# Altium schematic sheet Power_Circuit.SchDoc (part 1 of 3)
size A2; SheetNumber: 15; SheetTotal: 16
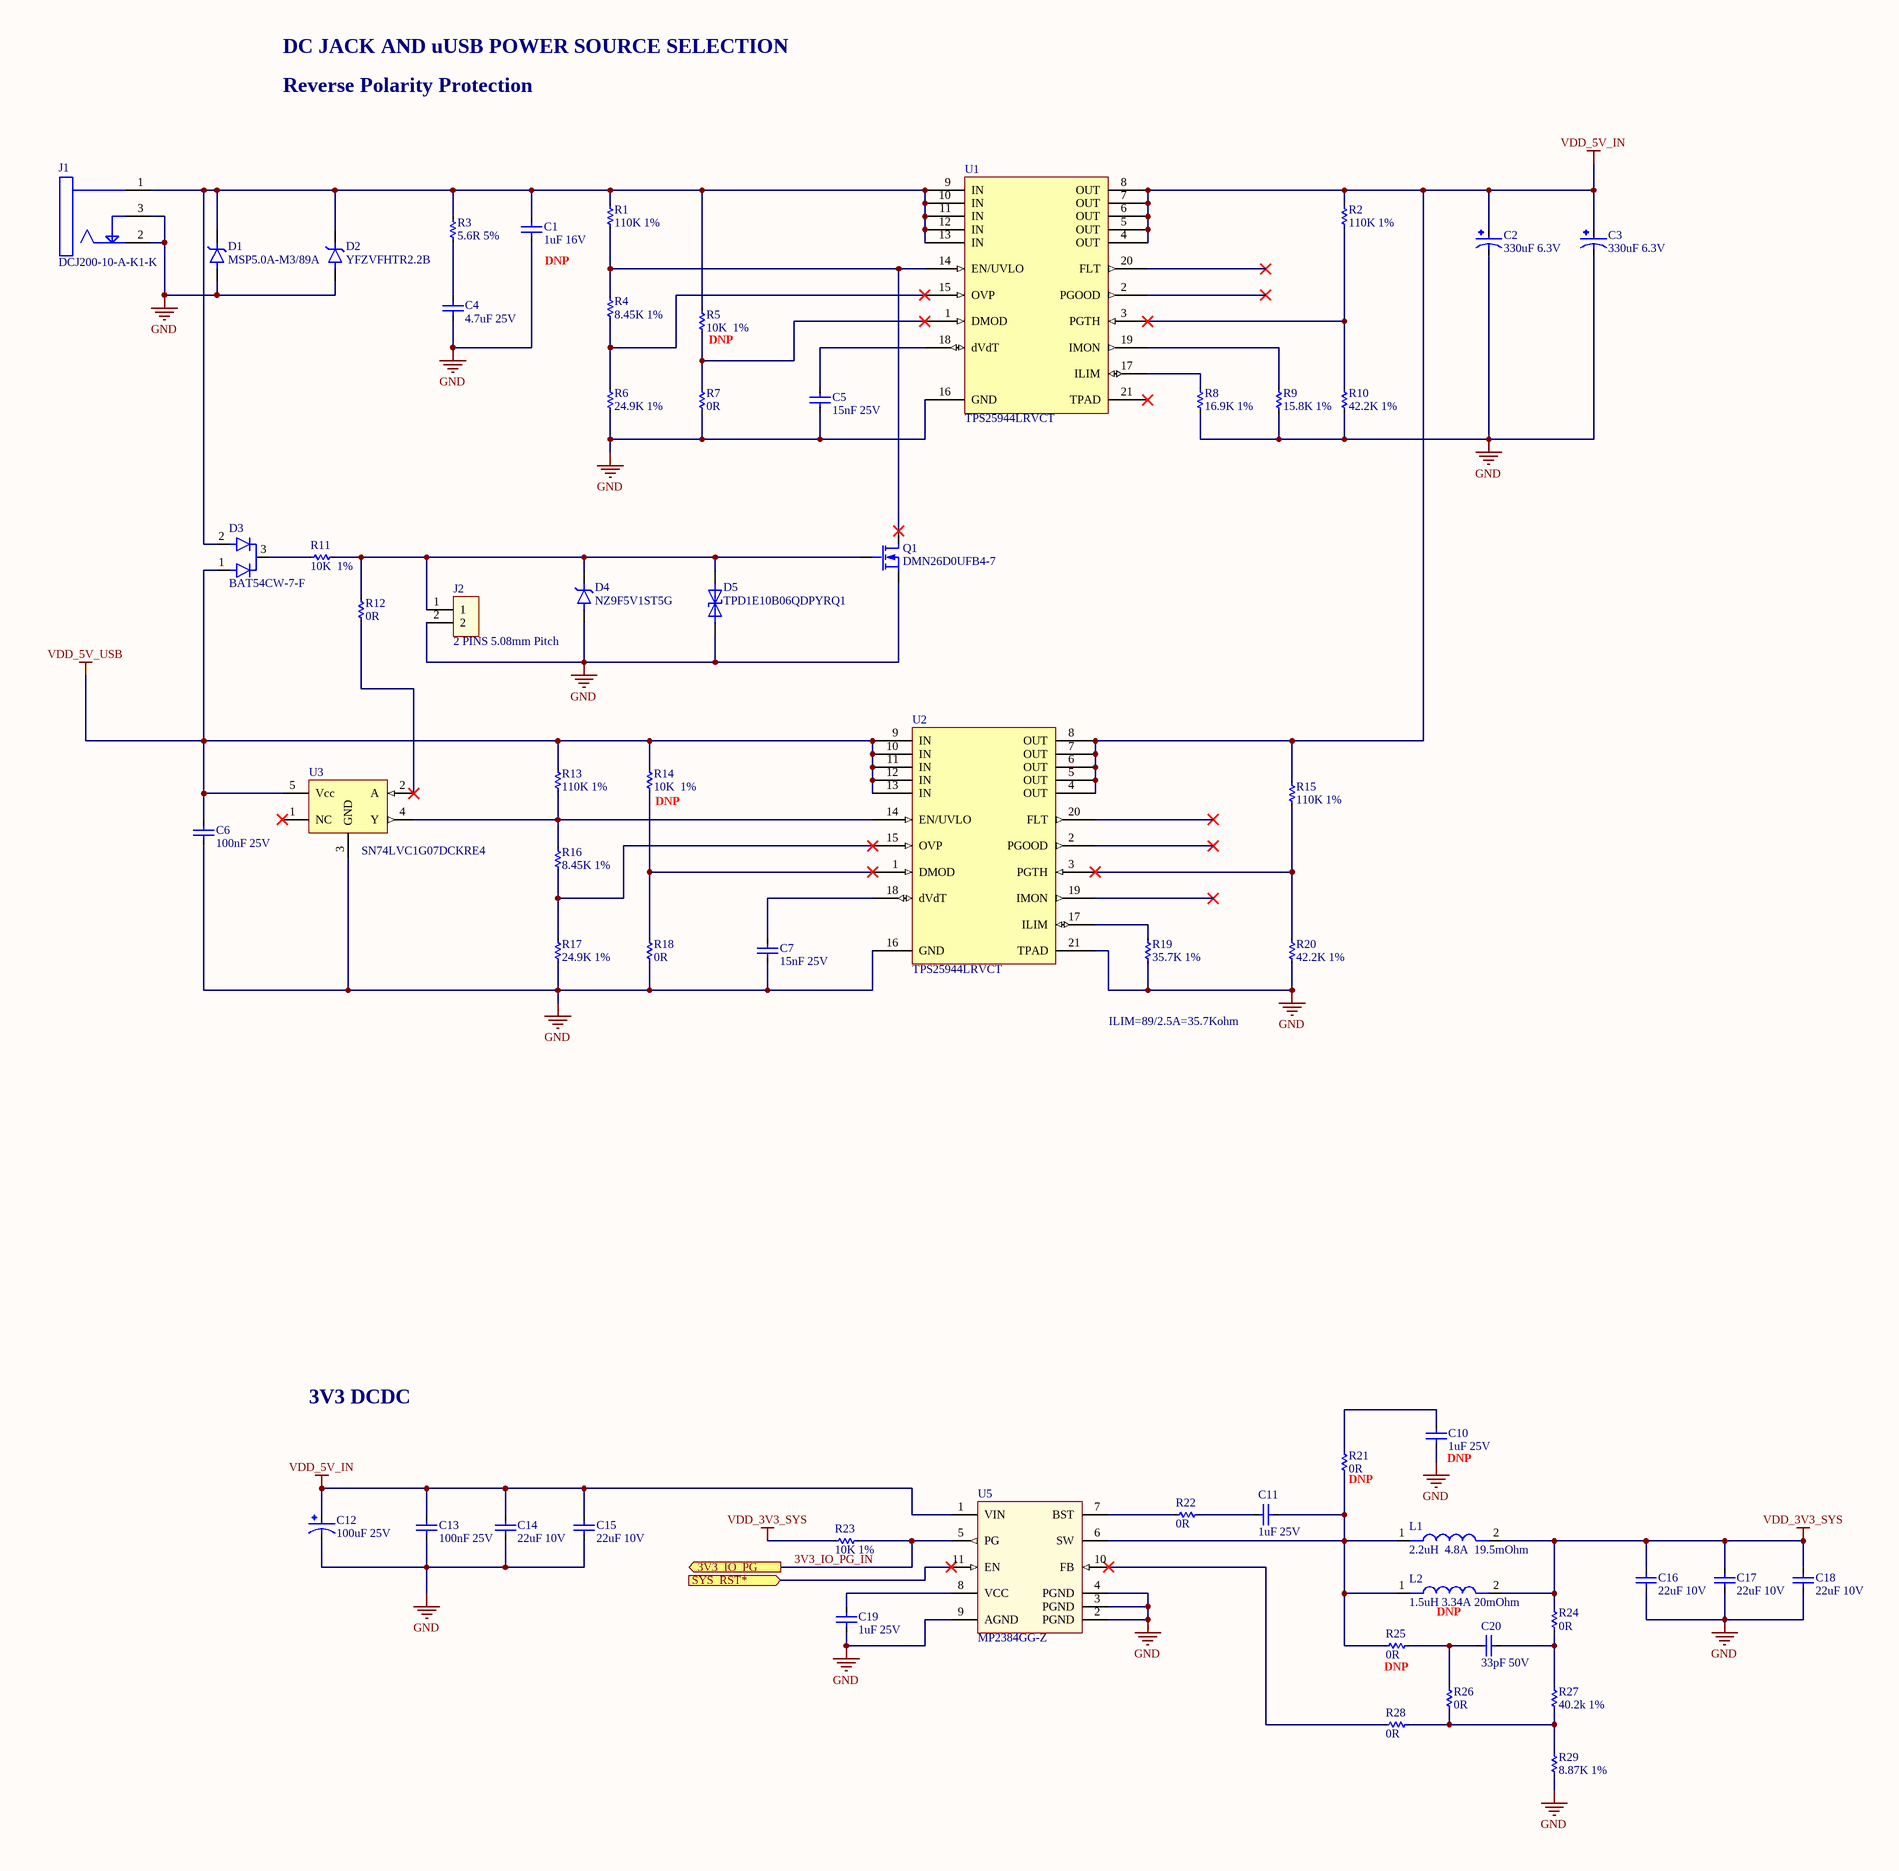
[diagram p0: Power_Circuit.SchDoc, left]
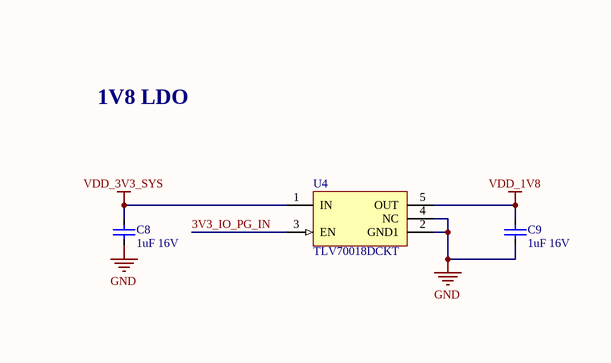
[diagram p1: Power_Circuit.SchDoc, right]

## Parts
C1  1uF 16V  [C0603]
C2  330uF 6.3V  [CP_ELEC_6.3x7.7]
C3  330uF 6.3V  [CP_ELEC_6.3x7.7]
C4  4.7uF 25V  [C0603]
C5  15nF 25V  [C0805]
C6  100nF 25V  [C0402]
C7  15nF 25V  [C0805]
C8  1uF 16V  [C0603]
C9  1uF 16V  [C0603]
C10  1uF 25V  [C0603]
C11  1uF 25V  [C0603]
C12  100uF 25V  [C2917_Tantalum]
C13  100nF 25V  [C0402]
C14  22uF 10V  [C0805]
C15  22uF 10V  [C0805]
C16  22uF 10V  [C0805]
C17  22uF 10V  [C0805]
C18  22uF 10V  [C0805]
C19  1uF 25V  [C0603]
C20  33pF 50V  [C0402]
D1  MSP5.0A-M3/89A  [DO-219AD]
D2  YFZVFHTR2.2B  [YFZVFHTR22B]
D3  BAT54CW-7-F  [SOT-323]
D4  NZ9F5V1ST5G  [SOD-923]
D5  TPD1E10B06QDPYRQ1  [2-X1SON (1x.60)]
J1  DCJ200-10-A-K1-K  [DCJ200-10-A-K1-K]
J2  2 PINS 5.08mm Pitch  [0395443002]
L1  2.2uH  4.8A  19.5mOhm  [NRS8030T2R2NJGJ]
L2  1.5uH 3.34A 20mOhm  [ASPI-4030S-1R5N-T]
Q1  DMN26D0UFB4-7  [DFN1006-3]
R1  110K 1%  [R0402]
R2  110K 1%  [R0402]
R3  5.6R 5%  [R0402]
R4  8.45K 1%  [R0402]
R5  10K  1%  [R0402]
R6  24.9K 1%  [R0402]
R7  0R  [R0603]
R8  16.9K 1%  [R0402]
R9  15.8K 1%  [R0603]
R10  42.2K 1%  [R0402]
R11  10K  1%  [R0402]
R12  0R  [R0603]
R13  110K 1%  [R0402]
R14  10K  1%  [R0402]
R15  110K 1%  [R0402]
R16  8.45K 1%  [R0402]
R17  24.9K 1%  [R0402]
R18  0R  [R0603]
R19  35.7K 1%  [R0402]
R20  42.2K 1%  [R0402]
R21  0R  [R0603]
R22  0R  [R0603]
R23  10K 1%  [R0603]
R24  0R  [R0603]
R25  0R  [R0603]
R26  0R  [R0603]
R27  40.2k 1%  [R0402]
R28  0R  [R0603]
R29  8.87K 1%  [R0402]
U1  TPS25944LRVCT  [WQFN (3x4)-20]
U2  TPS25944LRVCT  [WQFN (3x4)-20]
U3  SN74LVC1G07DCKRE4  [SC70-5]
U4  TLV70018DCKT  [SC70-5]
U5  MP2384GG-Z  [QFN(2X2)-11]

## Ports
3V3_IO_PG (out), SYS_RST* (in)

## Nets
GND: C1.1 C2.2(-) C3.2(-) C4.1 C5.1 C6.1 C7.1 C8.1 C9.1 C10.2 C12.2(-) C13.2 C14.1 C15.1 C16.1 C17.1 C18.1 C19.1 D1.1(A) D2.2(A) D4.2(A) D5.1 J1.2 J1.3 J2.2 Q1.2(S) R6.1 R7.1 R8.1 R9.1 R10.1 R17.1 R18.1 R19.1 R20.1 R29.1 U1.16(GND) U2.16(GND) U2.21(TPAD) U3.3(GND) U4.2(GND1) U4.4(NC) U5.2(PGND) U5.3(PGND) U5.4(PGND) U5.9(AGND)
VDD_1V8: C9.2 U4.5(OUT)
VDD_3V3_SYS: C8.2 C16.2 C17.2 C18.2 L1.2 L2.2 R23.1 R24.1 U4.1(IN)
VDD_5V_IN: C2.1(+1) C3.1(+1) C12.1(+1) C13.1 C14.2 C15.2 R2.2 R15.2 U1.4(OUT) U1.5(OUT) U1.6(OUT) U1.7(OUT) U1.8(OUT) U2.4(OUT) U2.5(OUT) U2.6(OUT) U2.7(OUT) U2.8(OUT) U5.1(VIN)
VDD_5V_USB: C6.2 D3.1 R13.2 R14.2 U2.9(IN) U2.10(IN) U2.11(IN) U2.12(IN) U2.13(IN) U3.5(Vcc)
3V3_IO_PG_IN: R23.2 U4.3(EN) U5.5(PG) ; port 3V3_IO_PG
SYS_RST*: U5.11(EN) ; port SYS_RST*
NetC1_2: C1.2 D1.2(C) D2.1(K) D3.2 J1.1 R1.2 R3.2 R5.2 U1.9(IN) U1.10(IN) U1.11(IN) U1.12(IN) U1.13(IN)
NetC4_2: C4.2 R3.1
NetC5_2: C5.2 U1.18(dVdT)
NetC7_2: C7.2 U2.18(dVdT)
NetC10_1: C10.1 R21.1
NetC11_1: C11.1 R22.1
NetC11_2: C11.2 L1.1 L2.1 R21.2 R25.2 U5.6(SW)
NetC19_2: C19.2 U5.8(VCC)
NetC20_1: C20.1 R25.1 R26.1
NetC20_2: C20.2 R24.2 R27.2
NetD3_3: D3.3 R11.2
NetD4_1: D4.1(K) D5.2 J2.1 Q1.1(G) R11.1 R12.2
NetQ1_3: Q1.3(D) R1.1 R4.2 U1.14(EN/UVLO)
NetR2_1: R2.1 R10.2 U1.3(PGTH)
NetR4_1: R4.1 R6.2 U1.15(OVP)
NetR5_1: R5.1 R7.2 U1.1(DMOD)
NetR8_2: R8.2 U1.17(ILIM)
NetR9_2: R9.2 U1.19(IMON)
NetR12_1: R12.1 U3.2(A)
NetR13_1: R13.1 R16.2 U2.14(EN/UVLO) U3.4(Y)
NetR14_1: R14.1 R18.2 U2.1(DMOD)
NetR15_1: R15.1 R20.2 U2.3(PGTH)
NetR16_1: R16.1 R17.2 U2.15(OVP)
NetR19_2: R19.2 U2.17(ILIM)
NetR22_2: R22.2 U5.7(BST)
NetR26_2: R26.2 R27.1 R28.2 R29.2
NetR28_1: R28.1 U5.10(FB)

Not connected (* = marked no-connect by the designer): U1 2(PGOOD)* 20(FLT)* 21(TPAD)*; U2 2(PGOOD)* 19(IMON)* 20(FLT)*; U3 1(NC)*

## Notes on the sheet
- DC JACK AND uUSB POWER SOURCE SELECTION
- Reverse Polarity Protection
- (near C1) DNP
- 1V8 LDO
- (near R5) DNP
- (near R14) DNP
- ILIM=89/2.5A=35.7Kohm
- 3V3 DCDC
- (near R21) DNP
- (near C10) DNP
- (near L2) DNP
- (near R25) DNP